# Altium schematic sheet top_level.SchDoc: top level
size A3; DrawnBy: Elio F; Engineer: Elio F; Revision: 1.0; SheetNumber: 2; SheetTotal: 11; Sheet Title: Top Level
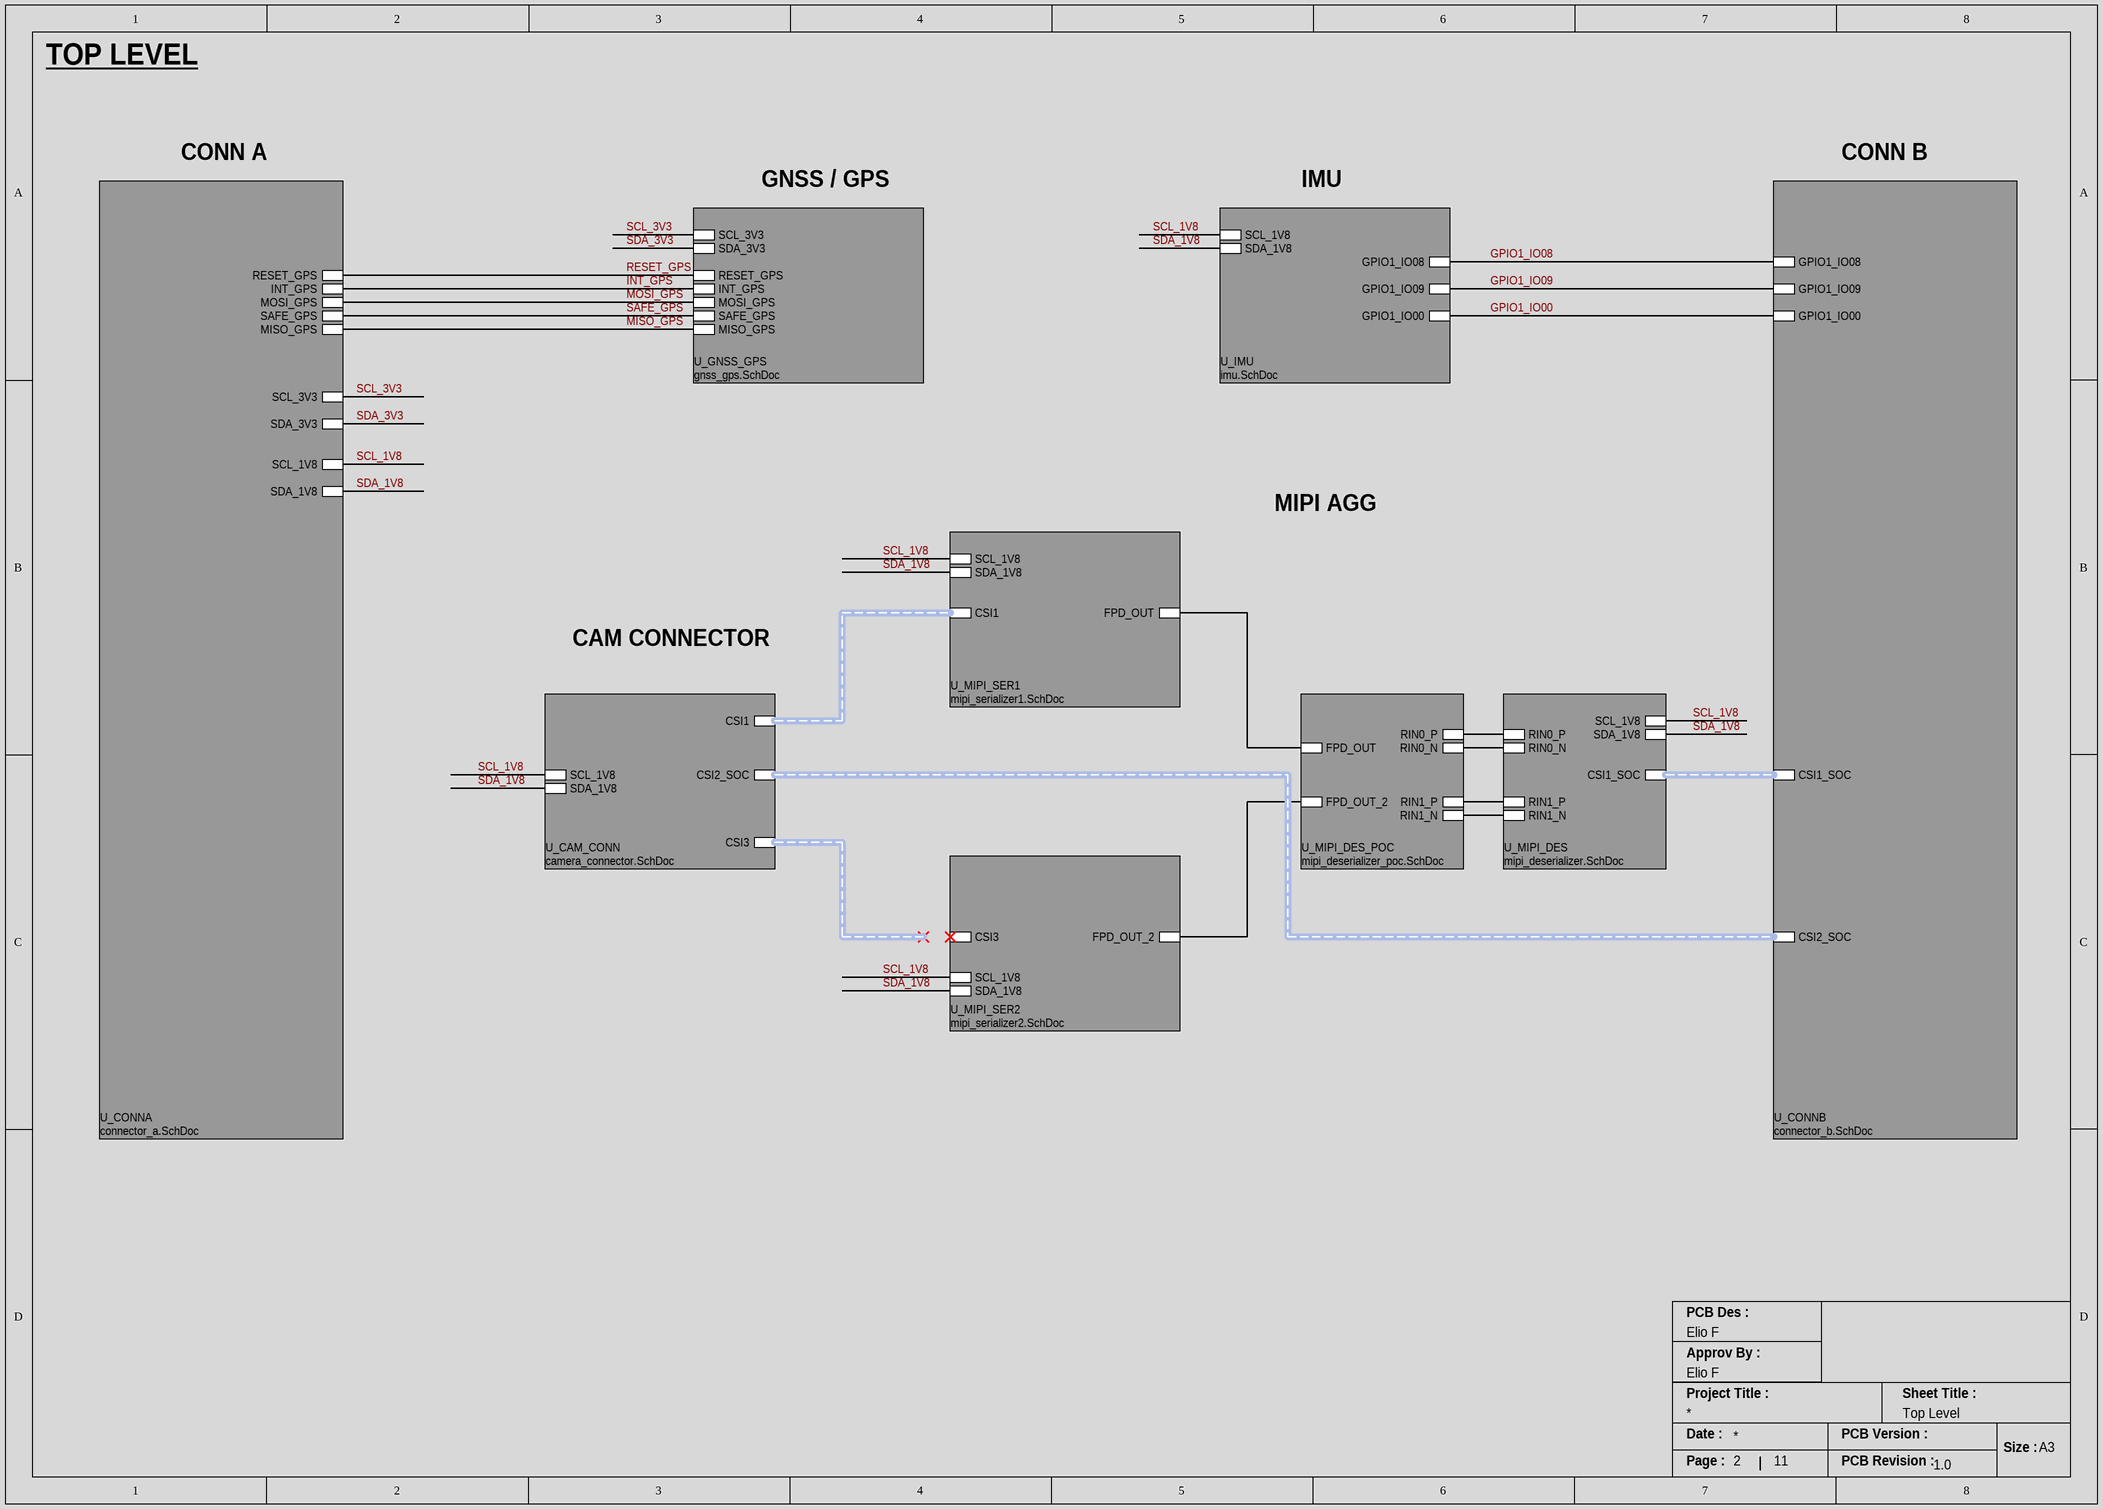
[diagram p0: top_level.SchDoc]

## Sub-sheets
U_CAM_CONN = camera_connector.SchDoc: CSI1 (harness CSI1), CSI3 (harness CSI3), CSI2_SOC (harness CSI2_SOC), SCL_1V8, SDA_1V8
U_CONNA = connector_a.SchDoc: SCL_3V3, SDA_3V3, RESET_GPS, INT_GPS, MOSI_GPS, SAFE_GPS, MISO_GPS, SCL_1V8, SDA_1V8
U_CONNB = connector_b.SchDoc: CSI2_SOC (harness CSI2_SOC), CSI1_SOC (harness CSI1_SOC), GPIO1_IO08, GPIO1_IO09, GPIO1_IO00
U_GNSS_GPS = gnss_gps.SchDoc: RESET_GPS, INT_GPS, MISO_GPS, MOSI_GPS, SAFE_GPS, SCL_3V3, SDA_3V3
U_IMU = imu.SchDoc: GPIO1_IO08, GPIO1_IO09, GPIO1_IO00, SCL_1V8, SDA_1V8
U_MIPI_DES = mipi_deserializer.SchDoc: RIN0_P, RIN0_N, RIN1_P, RIN1_N, CSI1_SOC (harness CSI1_SOC), SCL_1V8, SDA_1V8
U_MIPI_DES_POC = mipi_deserializer_poc.SchDoc: FPD_OUT, FPD_OUT_2, RIN0_P, RIN0_N, RIN1_P, RIN1_N
U_MIPI_SER1 = mipi_serializer1.SchDoc: CSI1 (harness CSI1), FPD_OUT, SCL_1V8, SDA_1V8
U_MIPI_SER2 = mipi_serializer2.SchDoc: CSI3 (harness CSI3), FPD_OUT_2, SCL_1V8, SDA_1V8

## Nets
GPIO1_IO00: sheet U_CONNB/GPIO1_IO00, sheet U_IMU/GPIO1_IO00
GPIO1_IO08: sheet U_CONNB/GPIO1_IO08, sheet U_IMU/GPIO1_IO08
GPIO1_IO09: sheet U_CONNB/GPIO1_IO09, sheet U_IMU/GPIO1_IO09
INT_GPS: sheet U_CONNA/INT_GPS, sheet U_GNSS_GPS/INT_GPS
MISO_GPS: sheet U_CONNA/MISO_GPS, sheet U_GNSS_GPS/MISO_GPS
MOSI_GPS: sheet U_CONNA/MOSI_GPS, sheet U_GNSS_GPS/MOSI_GPS
RESET_GPS: sheet U_CONNA/RESET_GPS, sheet U_GNSS_GPS/RESET_GPS
SAFE_GPS: sheet U_CONNA/SAFE_GPS, sheet U_GNSS_GPS/SAFE_GPS
SCL_1V8: sheet U_CONNA/SCL_1V8, sheet U_IMU/SCL_1V8, sheet U_MIPI_SER1/SCL_1V8, sheet U_CAM_CONN/SCL_1V8, sheet U_MIPI_SER2/SCL_1V8, sheet U_MIPI_DES/SCL_1V8
SCL_3V3: sheet U_CONNA/SCL_3V3, sheet U_GNSS_GPS/SCL_3V3
SDA_1V8: sheet U_CONNA/SDA_1V8, sheet U_IMU/SDA_1V8, sheet U_MIPI_SER1/SDA_1V8, sheet U_CAM_CONN/SDA_1V8, sheet U_MIPI_SER2/SDA_1V8, sheet U_MIPI_DES/SDA_1V8
SDA_3V3: sheet U_CONNA/SDA_3V3, sheet U_GNSS_GPS/SDA_3V3
(unnamed): sheet U_MIPI_SER1/FPD_OUT, sheet U_MIPI_DES_POC/FPD_OUT
(unnamed): sheet U_MIPI_SER2/FPD_OUT_2, sheet U_MIPI_DES_POC/FPD_OUT_2
(unnamed): sheet U_MIPI_DES/RIN0_P, sheet U_MIPI_DES_POC/RIN0_P
(unnamed): sheet U_MIPI_DES/RIN0_N, sheet U_MIPI_DES_POC/RIN0_N
(unnamed): sheet U_MIPI_DES/RIN1_P, sheet U_MIPI_DES_POC/RIN1_P
(unnamed): sheet U_MIPI_DES/RIN1_N, sheet U_MIPI_DES_POC/RIN1_N

## Buses and harness runs
harness sheet U_CAM_CONN/CSI1 = sheet U_MIPI_SER1/CSI1
harness sheet U_CAM_CONN/CSI2_SOC = sheet U_CONNB/CSI2_SOC
harness sheet U_CONNB/CSI1_SOC = sheet U_MIPI_DES/CSI1_SOC

## Notes on the sheet
- TOP LEVEL
- CONN A
- CONN B
- GNSS / GPS
- IMU
- MIPI AGG
- CAM CONNECTOR
- PCB Des :
- Approv By :
- Project Title :
- Sheet Title :
- Date :
- PCB Version :
- Size :
- A3
- Page :
- PCB Revision :